# EAGLE design Scheme (EAGLE 7.2.0)
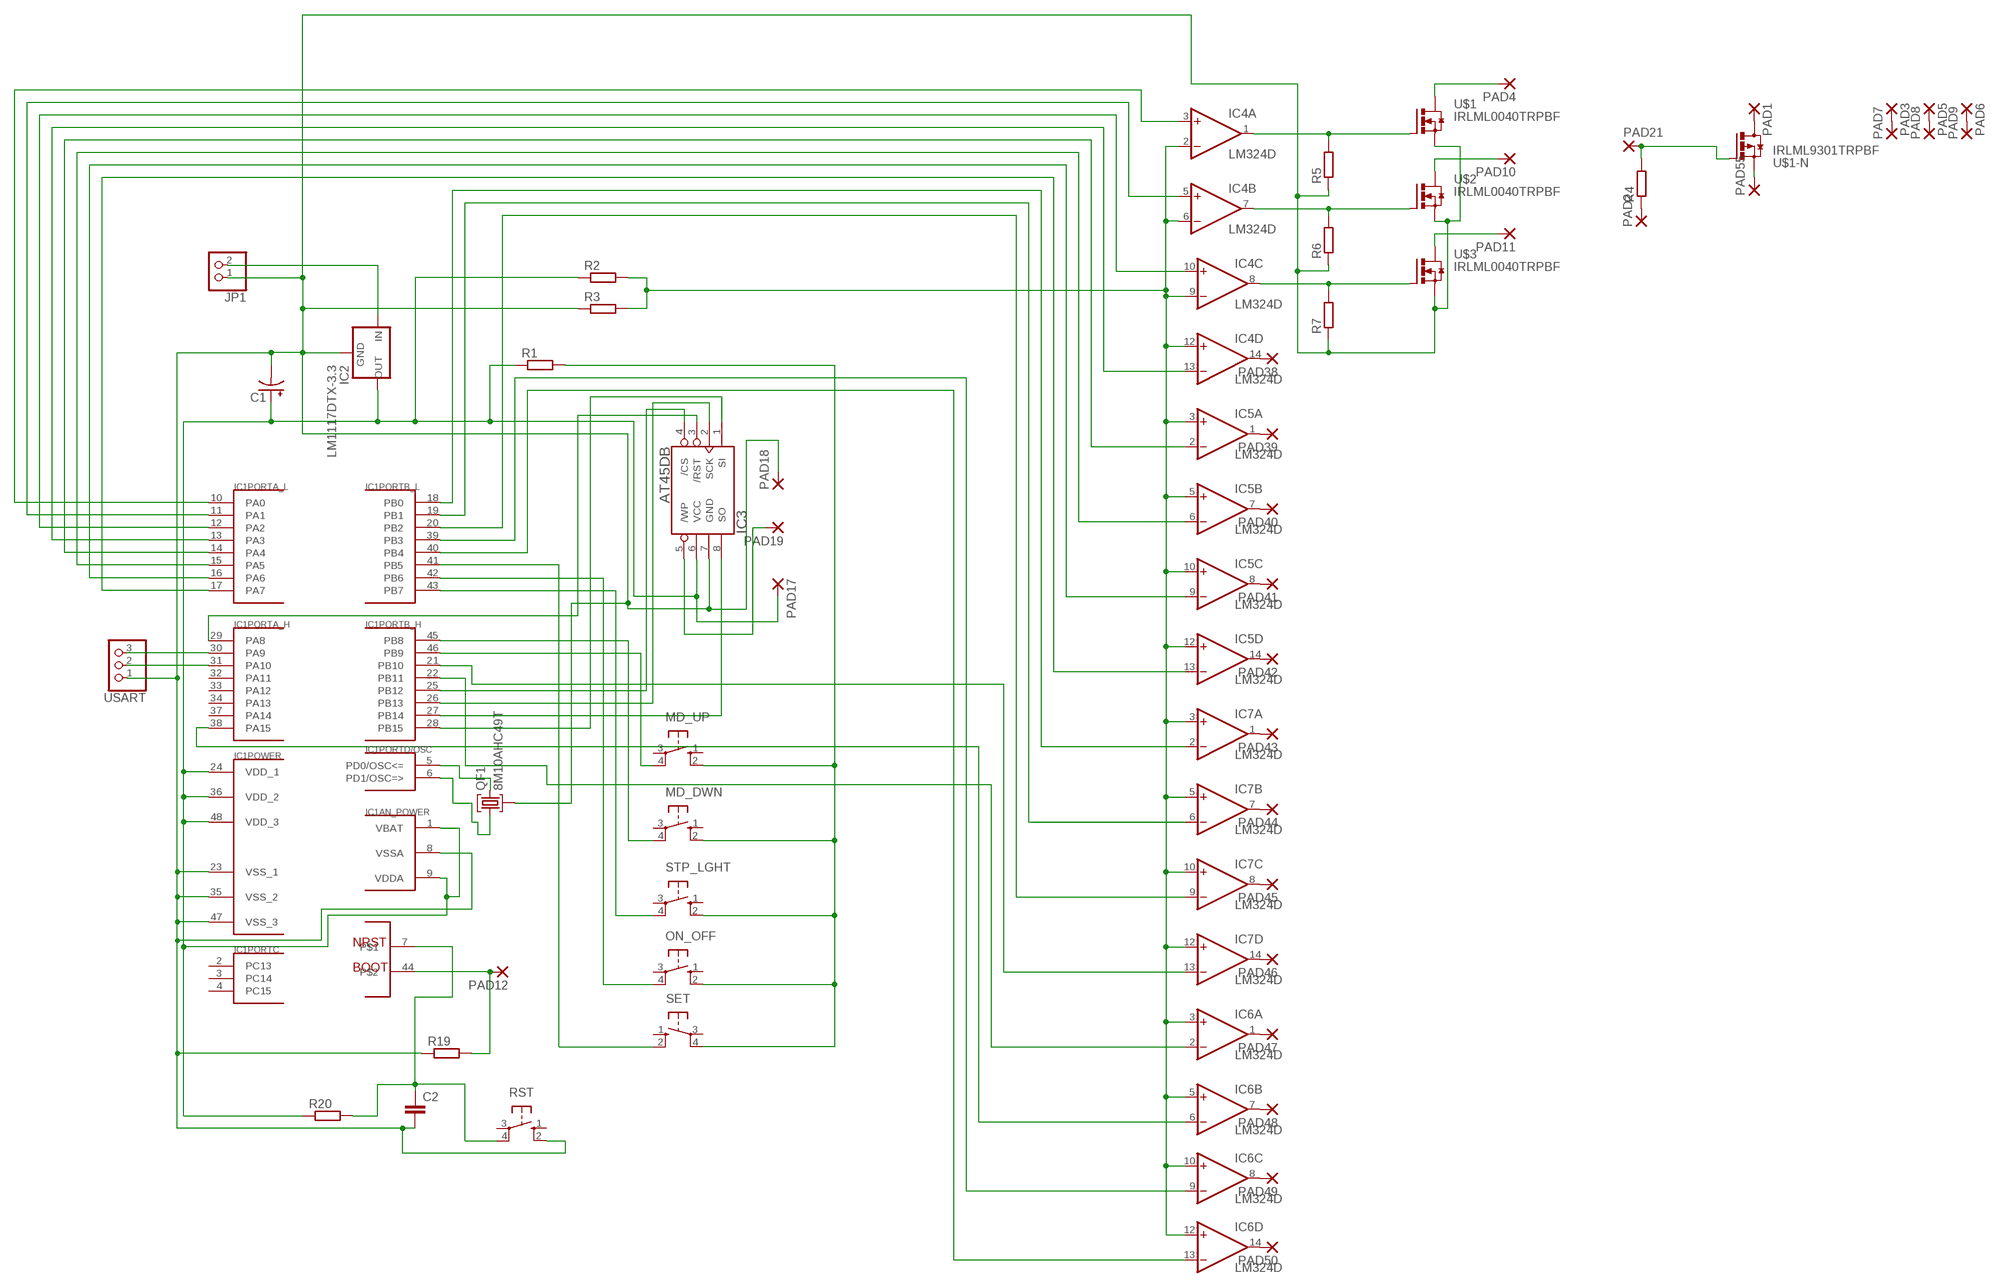
[diagram p0: schematic, sheet 1]

## Parts
C1  CPOL-USSMCD  [SMC_D]
C2  C-EUC0805  [C0805]
IC1  STM32F10XCXT6  [TQFP48]
IC2  LM1117DTX-3.3  [TO252]
IC3  AT45DB-S  [SOIC8_208MIL]
IC4  LM324D  [SO14]
IC5  LM324D  [SO14]
IC6  LM324D  [SO14]
IC7  LM324D  [SO14]
JP1  PINHD-1X2  [1X02]
MD_DWN  40-XX  [B3F-40XX]
MD_UP  40-XX  [B3F-40XX]
ON_OFF  40-XX  [B3F-40XX]
PAD1  SMD2  [SMD1,27-2,54]
PAD2  SMD2  [SMD1,27-2,54]
PAD3  SMD2  [SMD1,27-2,54]
PAD4  SMD2  [SMD1,27-2,54]
PAD5  SMD2  [SMD1,27-2,54]
PAD6  SMD2  [SMD1,27-2,54]
PAD7  SMD2  [SMD1,27-2,54]
PAD8  SMD2  [SMD1,27-2,54]
PAD9  SMD2  [SMD1,27-2,54]
PAD10  SMD2  [SMD1,27-2,54]
PAD11  SMD2  [SMD1,27-2,54]
PAD12  SMD2  [SMD1,27-2,54]
PAD17  SMD2  [SMD1,27-2,54]
PAD18  SMD2  [SMD1,27-2,54]
PAD19  SMD2  [SMD1,27-2,54]
PAD21  SMD2  [SMD1,27-2,54]
PAD38  SMD2  [SMD1,27-2,54]
PAD39  SMD2  [SMD1,27-2,54]
PAD40  SMD2  [SMD1,27-2,54]
PAD41  SMD2  [SMD1,27-2,54]
PAD42  SMD2  [SMD1,27-2,54]
PAD43  SMD2  [SMD1,27-2,54]
PAD44  SMD2  [SMD1,27-2,54]
PAD45  SMD2  [SMD1,27-2,54]
PAD46  SMD2  [SMD1,27-2,54]
PAD47  SMD2  [SMD1,27-2,54]
PAD48  SMD2  [SMD1,27-2,54]
PAD49  SMD2  [SMD1,27-2,54]
PAD50  SMD2  [SMD1,27-2,54]
PAD55  SMD2  [SMD1,27-2,54]
QF1  8M10AHC49T  [HC49U]
R1  R-EU_R1206  [R1206]
R2  R-EU_R1206  [R1206]
R3  R-EU_R1206  [R1206]
R4  R-EU_R1206  [R1206]
R5  R-EU_R1206  [R1206]
R6  R-EU_R1206  [R1206]
R7  R-EU_R1206  [R1206]
R19  R-EU_R1206  [R1206]
R20  R-EU_R1206  [R1206]
RST  40-XX  [B3F-40XX]
SET  40-XX  [B3F-40XX]
STP_LGHT  40-XX  [B3F-40XX]
U$1  IRLML0040TRPBF  [MICRO3]
U$1-N  IRLML9301TRPBF  [MICRO3]
U$2  IRLML0040TRPBF  [MICRO3]
U$3  IRLML0040TRPBF  [MICRO3]
USART  PINHD-1X3  [1X03]

## Nets
N$1: PAD2.1(P) R4.1
N$2: C1.- C2.2 IC1.8(AN_POWER:VSSA) IC1.23(POWER:VSS_1) IC1.35(POWER:VSS_2) IC1.47(POWER:VSS_3) IC2.1(GND) IC3.7(GND) JP1.1 PAD18.1(P) QF1.2 R3.1 R5.1 R6.1 R7.1 R19.1 RST.2(S1) U$1.2(S) U$2.2(S) U$3.2(S) USART.1
N$3: PAD21.1(P) R4.2 U$1-N.1(G)
N$4: IC1.38(PORTA_H:PA15) IC6.6(B:-IN)
N$5: IC1.39(PORTB_L:PB3) IC6.9(C:-IN)
N$6: IC1.40(PORTB_L:PB4) IC6.13(D:-IN)
N$7: IC1.46(PORTB_H:PB9) MD_UP.4(P1)
N$8: IC1.45(PORTB_H:PB8) MD_DWN.4(P1)
N$9: IC1.43(PORTB_L:PB7) STP_LGHT.4(P1)
N$10: MD_DWN.2(S1) MD_UP.2(S1) ON_OFF.2(S1) R1.2 SET.4(P1) STP_LGHT.2(S1)
N$11: IC1.42(PORTB_L:PB6) ON_OFF.4(P1)
N$12: IC4.1(A:OUT) R5.2 U$1.1(G)
N$13: IC4.7(B:OUT) R6.2 U$2.1(G)
N$14: IC1.25(PORTB_H:PB12) IC3.4(/CS)
N$15: IC1.10(PORTA_L:PA0) IC4.3(A:+IN)
N$16: IC1.11(PORTA_L:PA1) IC4.5(B:+IN)
N$17: IC1.12(PORTA_L:PA2) IC4.10(C:+IN)
N$18: IC1.13(PORTA_L:PA3) IC4.13(D:-IN)
N$19: IC1.14(PORTA_L:PA4) IC5.2(A:-IN)
N$20: IC1.15(PORTA_L:PA5) IC5.6(B:-IN)
N$21: IC1.16(PORTA_L:PA6) IC5.9(C:-IN)
N$22: IC1.17(PORTA_L:PA7) IC5.13(D:-IN)
N$23: IC1.18(PORTB_L:PB0) IC7.2(A:-IN)
N$24: IC1.19(PORTB_L:PB1) IC7.6(B:-IN)
N$25: IC1.20(PORTB_L:PB2) IC7.9(C:-IN)
N$26: IC1.21(PORTB_H:PB10) IC7.13(D:-IN)
N$27: IC1.22(PORTB_H:PB11) IC6.2(A:-IN)
N$28: IC1.26(PORTB_H:PB13) IC3.2(SCK)
N$29: IC1.27(PORTB_H:PB14) IC3.8(SO)
N$30: IC1.28(PORTB_H:PB15) IC3.1(SI)
N$31: IC4.2(A:-IN) IC4.6(B:-IN) IC4.9(C:-IN) IC4.12(D:+IN) IC5.3(A:+IN) IC5.5(B:+IN) IC5.10(C:+IN) IC5.12(D:+IN) IC6.3(A:+IN) IC6.5(B:+IN) IC6.10(C:+IN) IC6.12(D:+IN) IC7.3(A:+IN) IC7.5(B:+IN) IC7.10(C:+IN) IC7.12(D:+IN) R2.2 R3.2
N$32: C1.+ IC1.1(AN_POWER:VBAT) IC1.9(AN_POWER:VDDA) IC1.24(POWER:VDD_1) IC1.36(POWER:VDD_2) IC1.48(POWER:VDD_3) IC2.TAB(OUT) IC3.6(VCC) PAD17.1(P) R1.1 R2.1 R20.1
N$33: IC4.8(C:OUT) R7.2 U$3.1(G)
N$34: PAD1.1(P) U$1-N.3(D)
N$35: IC1.41(PORTB_L:PB5) SET.2(S1)
N$36: PAD3.1(P) PAD7.1(P)
N$37: PAD5.1(P) PAD8.1(P)
N$38: PAD6.1(P) PAD9.1(P)
N$39: IC1.30(PORTA_H:PA9) USART.3
N$40: PAD4.1(P) U$1.3(D)
N$41: PAD10.1(P) U$2.3(D)
N$42: PAD11.1(P) U$3.3(D)
N$43: IC1.31(PORTA_H:PA10) USART.2
N$64: IC1.44 PAD12.1(P) R19.2
N$65: IC1.29(PORTA_H:PA8) IC3.3(/RST)
N$66: C2.1 IC1.7 R20.2 RST.4(P1)
N$67: IC3.5(/WP) PAD19.1(P)
N$68: IC1.5(PORTD/OSC:PD0/OSC<=) QF1.3
N$69: IC1.6(PORTD/OSC:PD1/OSC=>) QF1.1
N$71: IC4.14(D:OUT) PAD38.1(P)
N$72: IC5.1(A:OUT) PAD39.1(P)
N$73: IC5.7(B:OUT) PAD40.1(P)
N$74: IC5.8(C:OUT) PAD41.1(P)
N$75: IC5.14(D:OUT) PAD42.1(P)
N$76: IC7.1(A:OUT) PAD43.1(P)
N$77: IC7.7(B:OUT) PAD44.1(P)
N$78: IC7.14(D:OUT) PAD46.1(P)
N$79: IC6.1(A:OUT) PAD47.1(P)
N$80: IC6.7(B:OUT) PAD48.1(P)
N$81: IC6.8(C:OUT) PAD49.1(P)
N$82: IC6.14(D:OUT) PAD50.1(P)
N$83: IC7.8(C:OUT) PAD45.1(P)
N$84: IC2.2(IN) JP1.2
N$86: PAD55.1(P) U$1-N.2(S)
Unconnected: IC1.2(PORTC:PC13) IC1.3(PORTC:PC14) IC1.4(PORTC:PC15) IC1.32(PORTA_H:PA11) IC1.33(PORTA_H:PA12) IC1.34(PORTA_H:PA13) IC1.37(PORTA_H:PA14) MD_DWN.1(S) MD_DWN.3(P) MD_UP.1(S) MD_UP.3(P) ON_OFF.1(S) ON_OFF.3(P) RST.1(S) RST.3(P) SET.1(S) SET.3(P) STP_LGHT.1(S) STP_LGHT.3(P)

## Power pins joined to a net without a drawn wire
V+: IC4.4(P:V+) IC5.4(P:V+) IC6.4(P:V+) IC7.4(P:V+)
V-: IC4.11(P:V-) IC5.11(P:V-) IC6.11(P:V-) IC7.11(P:V-)

## Library data of the parts
C1 = rcl:CPOL-US: POLARIZED CAPACITOR, American symbol
C2 = resistor:C-EU: CAPACITOR, European symbol
IC1 = stm32:STM32F10XCXT6: ST STM32F101/103 48pin LQFP
IC2 = lm1117:LM1117DTX-*
IC3 = adafruit:AT45DB
IC4-IC7 = linear:LM324: OP AMP
JP1 = pinhead:PINHD-1X2: PIN HEADER
MD_DWN MD_UP ON_OFF RST SET STP_LGHT = switch-omron:40-XX: OMRON SWITCH; MF: OMRON COMPONENTS USA; MPN: B3F-4000; OC_FARNELL: 176434; OC_NEWARK: 36K3105
PAD1-PAD12 PAD17-PAD19 PAD21 PAD38-PAD50 PAD55 = wirepad:SMD2: SMD PAD
QF1 = crystal:8M10AHC49T: Monolithic Crystal Filters Source: www.vanlong.com; OC_FARNELL: unknown; OC_NEWARK: unknown
R1-R7 R19 R20 = resistor:R-EU_: RESISTOR, European symbol
U$1-U$3 = transistor-power:IRLML0040TRPBF: IRLML0040TRPbF NPN MOSFET 40 V 3.6 A
U$1-N = transistor-power:IRLML9301TRPBF: IRLML9301TRPbF P-MOSFET -30 V -3.6 A
USART = adafruit:PINHD-1X3: PIN HEADER

## Board
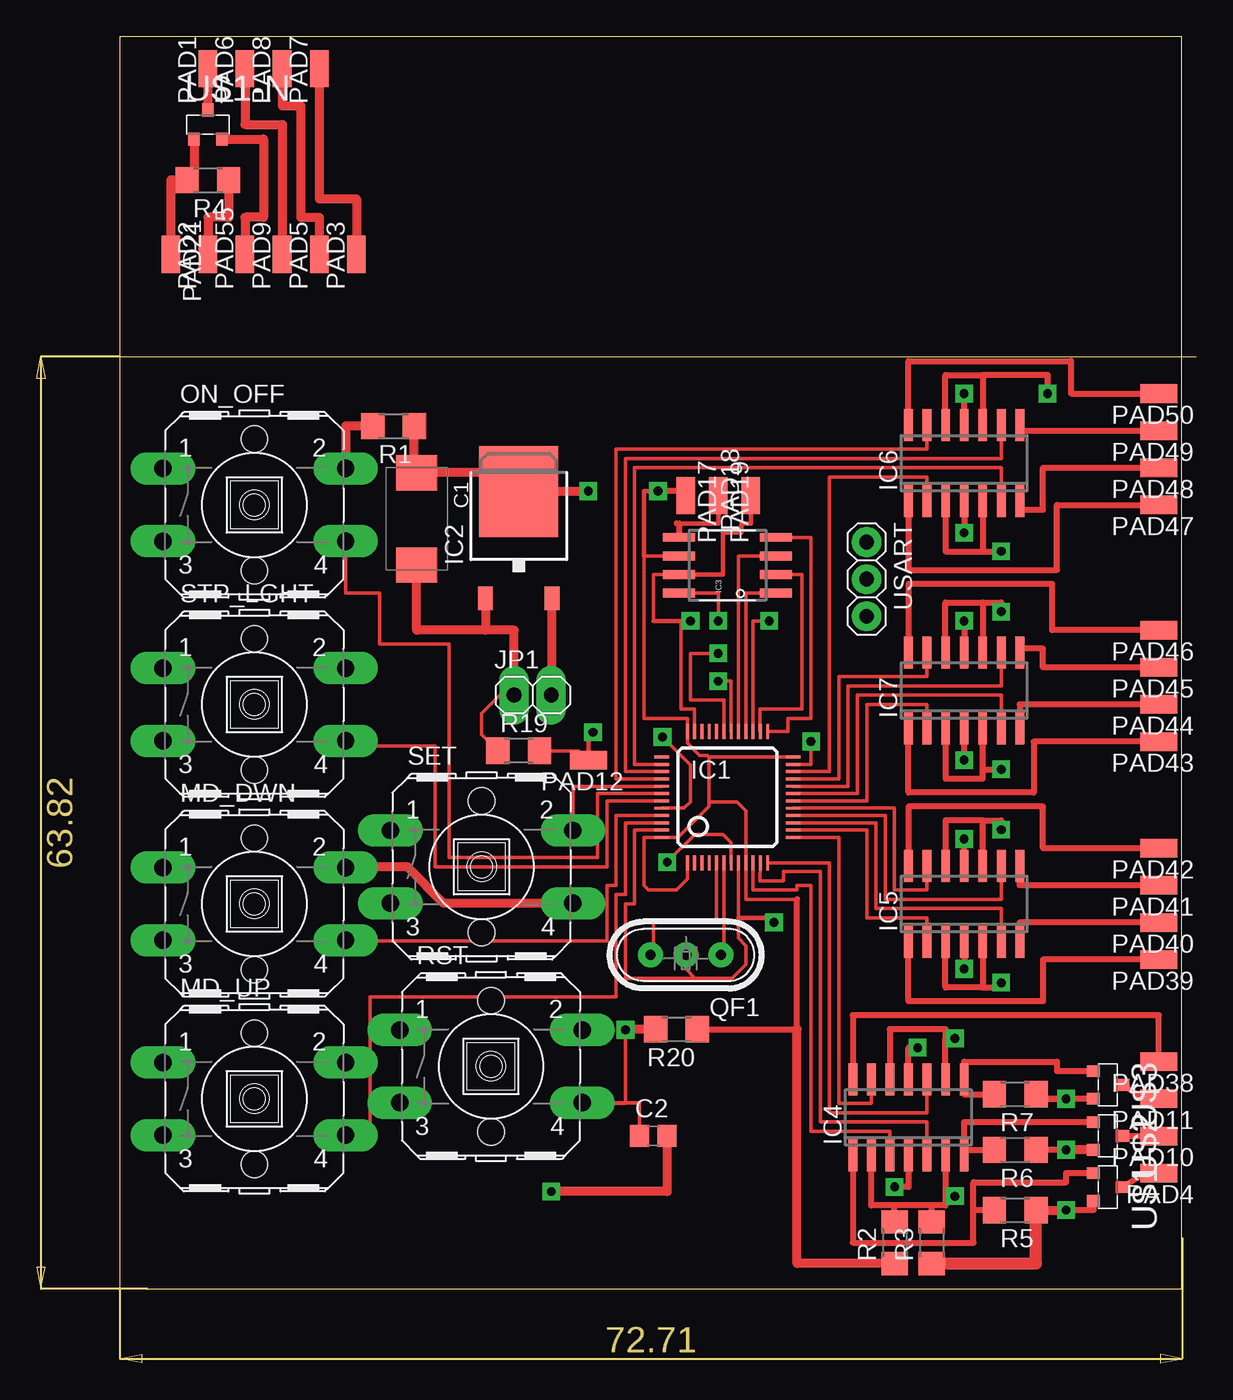
[diagram p1: board, top side]
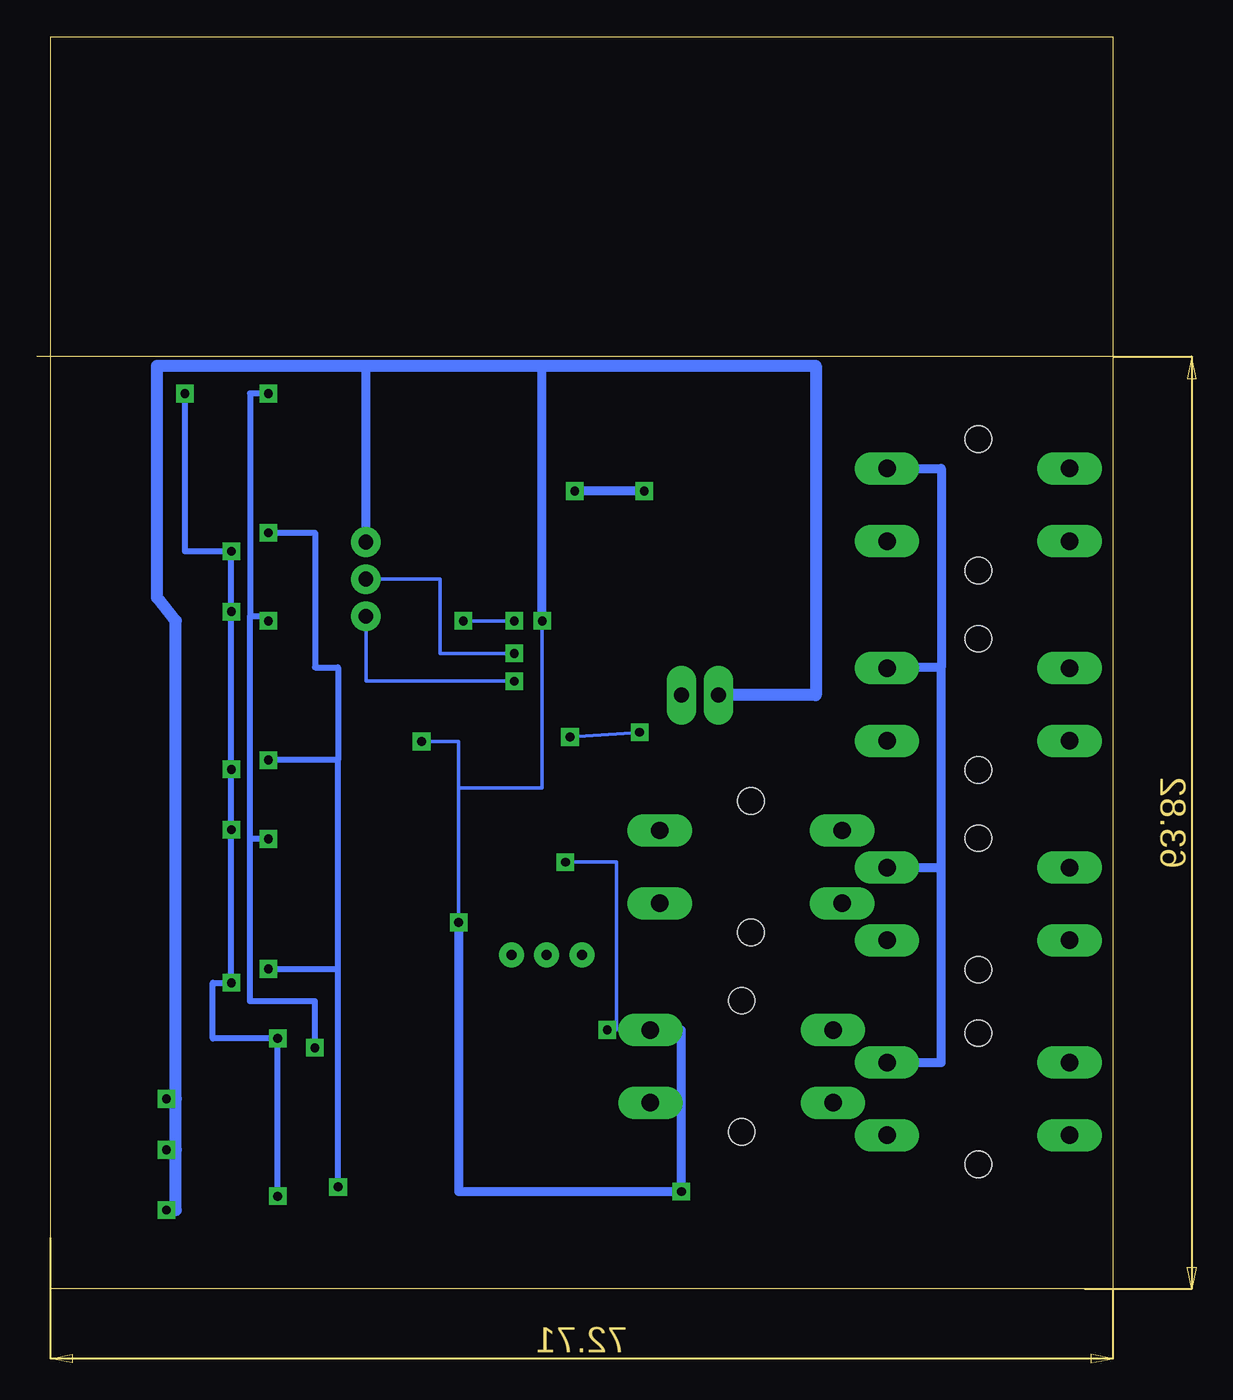
[diagram p2: board, bottom side, seen from below]

Size 73.66 x 85.71 mm. Coordinates in mm from the lower left corner, seen from the top.
Outline: 0,63.82 0,85.71 72.69,85.71 72.69,0 0,0 0,63.82
Outline: 0,63.82 73.66,63.82
Copper layers (1*16): Top 0.035mm / dielectric 1.5mm / Bottom 0.035mm
Design rules "default *": minimum track width 10mil, minimum drill 24mil, track to track 8mil, track to pad 8mil, pad to pad 8mil, via to via 8mil, smd to smd 8mil, copper to edge 40mil, drill to drill 8mil, minimum pad ring 20mil, minimum via ring 12mil, stop-mask expansion 4mil, vias tented up to drill 0mil, thermal gap 10mil

### Footprints (pad centres in the part's own frame; a part is rotated, then mirrored left to right if it is on the bottom)
SMC_D = smd 2.4 x 2.8: + -3.15,0; - 3.15,0
C0805 = smd 1.3 x 1.5: 1 -0.95,0; 2 0.95,0
TQFP48 = smd 0.2 x 1: 1 -2.75,-4.5; 2 -2.25,-4.5; 3 -1.75,-4.5; 4 -1.25,-4.5; 5 -0.75,-4.5; 6 -0.25,-4.5; 7 0.25,-4.5; 8 0.75,-4.5; 9 1.25,-4.5; 10 1.75,-4.5; 11 2.25,-4.5; 12 2.75,-4.5; 25 2.75,4.5; 26 2.25,4.5; 27 1.75,4.5; 28 1.25,4.5; 29 0.75,4.5; 30 0.25,4.5; 31 -0.25,4.5; 32 -0.75,4.5; 33 -1.25,4.5; 34 -1.75,4.5; 35 -2.25,4.5; 36 -2.75,4.5 | smd 1 x 0.2: 13 4.5,-2.75; 14 4.5,-2.25; 15 4.5,-1.75; 16 4.5,-1.25; 17 4.5,-0.75; 18 4.5,-0.25; 19 4.5,0.25; 20 4.5,0.75; 21 4.5,1.25; 22 4.5,1.75; 23 4.5,2.25; 24 4.5,2.75; 37 -4.5,2.75; 38 -4.5,2.25; 39 -4.5,1.75; 40 -4.5,1.25; 41 -4.5,0.75; 42 -4.5,0.25; 43 -4.5,-0.25; 44 -4.5,-0.75; 45 -4.5,-1.25; 46 -4.5,-1.75; 47 -4.5,-2.25; 48 -4.5,-2.75
TO252 = smd 1 x 1.6: 1 -2.28,-4.8; 2 2.28,-4.8 | smd 5.4 x 6.2: TAB 0,2.5
SOIC8_208MIL = smd 0.6 x 2.2: 1 -1.905,-3.315; 2 -0.635,-3.315; 3 0.635,-3.315; 4 1.905,-3.315; 5 1.905,3.315; 6 0.635,3.315; 7 -0.635,3.315; 8 -1.905,3.315
SO14 = smd 0.6 x 2.2: 1 -3.81,-2.6; 2 -2.54,-2.6; 3 -1.27,-2.6; 4 0,-2.6; 5 1.27,-2.6; 6 2.54,-2.6; 7 3.81,-2.6; 8 3.81,2.6; 9 2.54,2.6; 10 1.27,2.6; 11 0,2.6; 12 -1.27,2.6; 13 -2.54,2.6; 14 -3.81,2.6
1X02 = drill 1.016 long: 1 -1.27,0; 2 1.27,0
B3F-40XX = drill 1.194 long: 1 -6.248,2.489; 2 6.248,2.489; 3 -6.248,-2.489; 4 6.248,-2.489 | hole 1.803: 0,-4.496; 0,4.496
SMD1,27-2,54 = smd 1.27 x 2.54: 1 0,0
HC49U = drill 0.7 pad 1.2: 1 -2.413,0; 2 -0.027,0; 3 2.413,0
R1206 = smd 1.6 x 1.803: 1 -1.422,0; 2 1.422,0
MICRO3 = smd 0.8 x 0.9: 1 -0.95,-1; 2 0.95,-1; 3 0,1
1X03 = drill 1.016: 1 -2.54,0; 2 0,0; 3 2.54,0

### Placement (x,y rotation side)
C1  20.32,52.7 270 top
C2  36.51,10.48 0 top
IC1  41.59,33.66 0 top
IC2  27.3,52.07 0 top
IC3  41.59,49.53 90 top
IC4  53.98,11.75 0 top
IC5  57.78,26.35 0 top
IC6  57.78,56.52 0 top
IC7  57.78,40.96 0 top
JP1  28.26,40.64 0 top
MD_DWN  9.21,26.35 0 top
MD_UP  9.21,13.02 0 top
ON_OFF  9.21,53.66 0 top
PAD1  6.03,83.5 0 top
PAD2  6.03,70.8 0 top
PAD3  16.19,70.8 0 top
PAD4  71.12,7.94 90 top
PAD5  13.65,70.8 0 top
PAD6  8.57,83.5 0 top
PAD7  13.65,83.5 0 top
PAD8  11.11,83.5 0 top
PAD9  11.11,70.8 0 top
PAD10  71.12,10.48 90 top
PAD11  71.12,13.02 90 top
PAD12  32.07,36.2 90 top
PAD17  38.73,54.29 180 top
PAD18  43.18,54.29 0 top
PAD19  40.96,54.29 180 top
PAD21  3.49,70.8 180 top
PAD38  71.12,15.56 90 top
PAD39  71.12,22.54 90 top
PAD40  71.12,25.08 90 top
PAD41  71.12,27.62 90 top
PAD42  71.12,30.16 90 top
PAD43  71.12,37.47 90 top
PAD44  71.12,40.01 90 top
PAD45  71.12,42.55 90 top
PAD46  71.12,45.09 90 top
PAD47  71.12,53.66 90 top
PAD48  71.12,56.2 90 top
PAD49  71.12,58.74 90 top
PAD50  71.12,61.28 90 top
PAD55  8.57,70.8 0 top
QF1  38.73,22.86 180 top
R1  18.73,59.05 180 top
R2  53.02,3.17 90 top
R3  55.56,3.17 90 top
R4  6.03,75.88 180 top
R5  61.28,5.4 180 top
R6  61.28,9.53 180 top
R7  61.28,13.34 180 top
R19  27.3,36.83 0 top
R20  38.1,17.78 180 top
RST  25.4,15.24 0 top
SET  24.77,28.89 0 top
STP_LGHT  9.21,40.01 0 top
U$1  67.63,6.99 270 top
U$1-N  6.03,79.69 0 top
U$2  67.63,10.48 270 top
U$3  67.63,13.97 270 top
USART  51.12,48.58 270 top

### Tracks (layer width: path | path; a pad name or v marks a point on that pad's centre or on a via)
N$1
  Top 0.61: R4.1 7.46,73.34 6.03,73.34 PAD2.1
N$2  (via drill 0.6)
  Top 0.254: 39.37,21.27 41.91,21.27 42.86,22.23 42.86,23.5 42.34,24.02 42.34,25.4 IC1.8 | 39.37,21.27 38.73,21.91 38.73,22.83 QF1.2 | v47.31,37.47 47.31,35.91 IC1.23 | 36.51,45.72 36.51,48.9 IC3.7 | IC1.47 35.24,31.41 35.24,26.35 34.61,26.35 34.61,21.27 39.37,21.27 | IC1.35 39.34,39.69 38.42,39.69 38.42,45.72 v39.05,45.72 | JP1.1 26.04,40.64 24.77,39.37 24.77,37.95 R19.1
  Top 0.305: PAD18.1 43.18,52.39 42.55,52.39 42.55,51.75 41.27,51.75 41.27,48.9 IC3.7 | v44.77,25.08 44.45,25.4 42.34,25.4 | 36.51,45.72 v39.05,45.72
  Top 0.406: R6.1 65.24,9.53 v64.77,9.53 | U$3.2 62.7,13.02 | 62.7,13.02 R7.1 | U$1.2 66.63,5.4 v64.77,5.4 | 62.7,13.02 65.24,13.02 v64.77,13.02
  Top 0.61: IC2.1 25.02,45.09 | 25.02,45.09 20.32,45.09 C1.- | C2.2 37.46,6.67 v29.53,6.67 | U$2.2 v64.77,9.53 | R5.1 v64.77,5.4 | JP1.1 26.99,45.09 25.02,45.09
  Top 0.813: R3.1 62.7,1.75 R5.1
  Bottom 0.254: v44.77,25.08 44.77,34.29 | 44.77,34.29 44.77,37.47 v47.31,37.47 | v39.05,45.72 39.05,34.29 44.77,34.29
  Bottom 0.61: RST.2 29.53,17.73 v29.53,6.67 44.77,6.67 v44.77,25.08 | v64.77,13.02 64.14,13.02 | v64.77,9.53 64.14,9.53 | v39.05,45.72 39.05,63.18 | USART.1 51.12,63.18
  Bottom 0.813: v64.77,5.4 64.14,5.4 64.14,9.53 64.14,13.02 64.14,45.72 65.41,47.31 65.41,63.18 51.12,63.18 39.05,63.18 20.32,63.18 20.32,40.64 JP1.1
N$3
  Top 0.61: U$1-N.1 5.08,75.88 R4.2 3.49,75.88 PAD21.1
N$4
  Top 0.254: IC1.38 35.24,35.91 35.24,56.2 60.33,56.2 IC6.6
N$5
  Top 0.254: IC1.39 34.61,35.41 34.61,56.83 60.33,56.83 IC6.9
N$6
  Top 0.254: IC1.40 33.97,34.91 33.97,57.47 55.24,57.47 IC6.13
N$7
  Top 0.254: MD_UP.4 14.5,10.48 17.14,10.48 17.14,20 33.97,20 33.97,26.99 34.61,26.99 34.61,31.91 IC1.46
N$8
  Top 0.254: 14.5,23.81 MD_DWN.4 15.46,23.81 33.34,23.81 33.34,27.62 33.97,27.62 33.97,32.41 IC1.45
N$9
  Top 0.254: IC1.43 33.34,33.41 33.34,28.89 21.59,28.89 21.59,37.15 15.46,37.15 STP_LGHT.4
N$10
  Top 0.61: R1.2 15.46,59.05 ON_OFF.2 | SET.4 22.17,26.4 19.68,28.89 15.51,28.89 MD_DWN.2
  Bottom 0.61: ON_OFF.2 11.75,56.15 11.75,42.55 | 11.75,42.55 14.5,42.55 STP_LGHT.2 | MD_DWN.2 11.75,28.84 | 11.75,28.84 11.75,42.55 | MD_UP.2 11.75,15.51 11.75,28.84
N$11
  Top 0.254: IC1.42 32.7,33.91 32.7,29.53 22.54,29.53 22.54,44.13 17.78,44.13 17.78,47.62 15.46,47.62 ON_OFF.4
N$12
  Top 0.406: IC4.1 50.16,3.17 58.42,3.17 58.42,5.4 | 58.42,5.4 58.42,7.3 64.77,7.3 64.77,7.93 U$1.1 | R5.2 58.42,5.4
N$13
  Top 0.406: 57.78,9.53 57.78,11.43 U$2.1 | IC4.7 57.78,9.53 | 57.78,9.53 R6.2
N$14
  Top 0.254: IC1.25 45.72,38.16 45.72,39.05 47.31,39.05 47.31,51.44 IC3.4
N$15
  Top 0.254: IC1.10 43.34,27.3 46.35,27.3 46.35,27.62 47.31,27.62 47.31,10.79 52.7,10.79 IC4.3
N$16
  Top 0.254: IC1.11 43.81,27.94 45.4,27.94 45.4,28.57 47.94,28.57 47.94,11.43 55.24,11.43 IC4.5
N$17
  Top 0.254: IC1.12 48.58,29.16 48.58,12.06 55.24,12.06 IC4.10
N$18
  Top 0.254: IC1.13 49.21,30.91 49.21,12.7 51.44,12.7 IC4.13
N$19
  Top 0.254: IC1.14 51.12,31.41 51.12,25.4 55.24,25.4 IC5.2
N$20
  Top 0.254: IC1.15 51.75,31.91 51.75,26.04 60.33,26.04 IC5.6
N$21
  Top 0.254: IC1.16 52.39,32.41 52.39,26.67 60.33,26.67 IC5.9
N$22
  Top 0.254: IC1.17 53.02,32.91 53.02,27.3 55.24,27.3 IC5.13
N$23
  Top 0.254: IC1.18 51.12,33.41 51.12,40.01 55.24,40.01 IC7.2
N$24
  Top 0.254: IC1.19 50.48,33.91 50.48,40.64 60.33,40.64 IC7.6
N$25
  Top 0.254: IC1.20 49.85,34.41 49.85,41.27 60.33,41.27 IC7.9
N$26
  Top 0.254: IC1.21 49.21,34.91 49.21,41.91 55.24,41.91 IC7.13
N$27
  Top 0.254: IC1.22 48.58,35.41 48.58,55.56 55.24,55.56 IC6.2
N$28
  Top 0.254: IC1.26 43.81,38.16 43.81,39.69 46.67,39.69 46.67,48.9 IC3.2
N$29  (via drill 0.6)
  Top 0.254: IC1.27 43.34,45.72 v44.45,45.72 | v40.96,45.72 40.96,47.62 IC3.8
  Bottom 0.254: v44.45,45.72 v40.96,45.72
N$30
  Top 0.254: IC1.28 42.86,38.16 42.86,47.62 IC3.1
N$31  (via drill 0.6)
  Top 0.406: IC6.3 56.52,50.48 59.05,50.48 | IC6.12 56.52,62.55 59.05,62.55 | 59.05,62.55 IC6.10 | IC6.5 59.05,50.48 | 59.05,50.48 v60.33,50.48 | v63.5,61.28 63.5,62.55 59.05,62.55 | IC7.12 56.52,46.99 59.05,46.99 | 59.05,46.99 IC7.10 | IC7.3 56.52,34.92 59.05,34.92 59.05,35.56 | 59.05,35.56 IC7.5 | 59.05,46.99 60.33,46.99 v60.33,46.35 | IC5.10 59.05,32.07 | 59.05,32.07 56.52,32.07 IC5.12 | IC5.5 59.05,20.64 | 59.05,20.64 56.52,20.64 IC5.3 | 59.05,35.56 v60.33,35.56 | 59.05,32.07 60.33,32.07 v60.33,31.43 | 59.05,20.64 60.33,20.64 v60.33,20.95 | IC4.9 56.52,17.14 | IC4.12 52.7,17.78 56.52,17.78 56.52,17.14 | 56.52,6.35 56.52,5.71 55.56,5.71 | 55.56,5.71 53.02,5.71 | 53.02,5.71 51.44,5.71 IC4.2 | 56.52,17.14 v57.15,17.14 | IC4.6 56.52,6.35 | 56.52,6.35 v57.15,6.35 | R3.2 55.56,5.71 | R2.2 53.02,5.71
  Bottom 0.406: v63.5,61.28 63.5,50.48 v60.33,50.48 v60.33,46.35 v60.33,35.56 v60.33,31.43 v60.33,20.95 61.59,20.95 61.59,17.14 v57.15,17.14 v57.15,6.35
N$32  (via drill 0.6)
  Top 0.254: IC1.24 40.32,36.41 | IC3.6 35.88,50.16 35.88,39.05 38.84,39.05 IC1.36 38.84,37.36 39.69,36.51 40.22,36.51 40.32,36.41 | 46.35,26.67 42.84,26.67 IC1.9 42.84,32.72 42.23,33.34 40.32,33.34 | 40.32,33.34 40.32,36.41 | 40.32,33.34 40.32,33.02 38.21,30.91 IC1.48 35.88,30.91 35.88,27.62 36.2,27.3 38.1,27.3 38.84,28.05 IC1.1
  Top 0.305: v36.83,54.61 35.88,54.61 35.88,50.16
  Top 0.406: R20.1 46.35,17.78 46.35,26.67 | PAD17.1 38.73,54.61 v36.83,54.61
  Top 0.61: 27.3,54.61 27.3,55.85 C1.+ 20.15,55.85 R1.1 | IC2.TAB 27.3,54.61 | 27.3,54.61 v32.07,54.61 | R2.1 46.35,1.75 46.35,17.78
  Bottom 0.61: v32.07,54.61 v36.83,54.61
N$33
  Top 0.406: U$3.1 64.14,14.92 64.14,15.56 57.78,15.55 IC4.8 57.78,13.34 R7.2
N$34
  Top 0.61: U$1-N.3 PAD1.1
N$35
  Top 0.254: IC1.41 31.01,34.41 SET.2
N$36
  Top 0.61: PAD7.1 13.65,74.61 16.19,74.61 PAD3.1
N$37
  Top 0.61: PAD8.1 11.11,80.96 12.38,80.96 12.38,73.34 13.65,73.34 PAD5.1
N$38
  Top 0.61: PAD6.1 8.57,79.69 11.11,79.69 PAD9.1
N$39  (via drill 0.6)
  Top 0.254: v40.96,41.59 41.84,41.59 IC1.30
  Bottom 0.254: USART.3 51.12,41.59 v40.96,41.59
N$40
  Top 0.406: U$1.3 70.17,7.94 PAD4.1
N$41
  Top 0.406: U$2.3 PAD10.1
N$42
  Top 0.406: U$3.3 70.17,13.02 PAD11.1
N$43  (via drill 0.6)
  Top 0.254: v40.96,43.5 39.05,43.5 39.05,40.32 41.34,40.32 IC1.31
  Bottom 0.254: USART.2 46.04,48.58 46.04,43.5 v40.96,43.5
N$64  (via drill 0.6)
  Top 0.254: IC1.44 38.62,32.91 39.05,33.34 39.05,35.88 v37.15,37.78 | v32.38,38.1 32.07,37.47 | R19.2 31.43,36.83 PAD12.1
  Top 0.305: 32.07,37.47 PAD12.1
  Bottom 0.254: v37.15,37.78 v32.38,38.1
N$65
  Top 0.254: IC1.29 42.34,50.16 IC3.3
N$66  (via drill 0.6)
  Top 0.254: IC1.7 41.84,30.55 41.27,31.11 39.37,31.11 v37.47,29.21 | v34.61,17.73 34.61,12.7 31.65,12.7 RST.4 35.56,12.75 C2.1
  Top 0.61: R20.2 34.61,17.78 v34.61,17.73
  Bottom 0.254: v37.47,29.21 33.97,29.21 33.97,17.73 v34.61,17.73
N$67
  Top 0.305: PAD19.1 40.96,52.39 38.1,52.39
  Top 0.406: 38.1,52.39 38.28,52.39 IC3.5
N$68
  Top 0.254: IC1.5 40.84,25.08 36.51,25.08 36.51,22.86 QF1.3
N$69
  Top 0.254: IC1.6 41.34,23.05 QF1.1
N$71
  Top 0.406: PAD38.1 71.12,18.73 50.16,18.73 IC4.14
N$72
  Top 0.406: PAD39.1 63.18,22.54 63.18,19.68 53.98,19.68 IC5.1
N$73
  Top 0.406: PAD40.1 61.59,25.08 IC5.7
N$74
  Top 0.406: PAD41.1 61.59,27.62 IC5.8
N$75
  Top 0.406: PAD42.1 63.18,30.16 63.18,33.02 53.98,33.02 IC5.14
N$76
  Top 0.406: PAD43.1 62.55,37.47 62.55,33.97 53.98,33.97 IC7.1
N$77
  Top 0.406: PAD44.1 61.59,40.01 IC7.7
N$78
  Top 0.406: PAD46.1 63.82,45.09 63.82,48.26 53.98,48.26 IC7.14
N$79
  Top 0.406: IC6.1 53.98,49.21 64.14,49.21 64.14,53.66 PAD47.1
N$80
  Top 0.406: IC6.7 61.59,53.34 63.18,53.34 63.18,56.2 PAD48.1
N$81
  Top 0.406: IC6.8 61.59,58.74 PAD49.1
N$82
  Top 0.406: IC6.14 53.98,63.5 65.09,63.5 65.09,61.28 PAD50.1
N$83
  Top 0.406: PAD45.1 63.18,42.55 63.18,43.81 61.59,43.81 IC7.8
N$84
  Top 0.61: JP1.2 29.59,40.64 IC2.2
N$86
  Top 0.61: U$1-N.2 9.84,78.69 9.84,73.34 8.57,73.34 PAD55.1
V+  (via drill 0.6)
  Top 0.406: IC6.4 v57.78,51.75 | v57.78,36.2 IC7.4 | IC5.4 v57.78,21.91 | IC4.4 53.98,6.99 v53.02,6.99
  Bottom 0.406: v57.78,51.75 54.61,51.75 54.61,42.55 53.02,42.55 53.02,36.2 | 53.02,36.2 v57.78,36.2 | v57.78,21.91 53.02,21.91 | 53.02,21.91 53.02,36.2 | v53.02,6.99 53.02,21.91
V-  (via drill 0.6)
  Top 0.406: IC6.11 v57.78,61.28 | v57.78,45.72 IC7.11 | IC5.11 v57.78,30.8 | IC4.11 53.98,16.51 v54.61,16.51
  Bottom 0.406: v57.78,61.28 59.05,61.28 59.05,46.04 | 59.05,46.04 57.78,46.04 v57.78,45.72 | v57.78,30.8 59.05,30.8 | 59.05,30.8 59.05,46.04 | v54.61,16.51 54.61,19.68 59.05,19.68 59.05,30.8